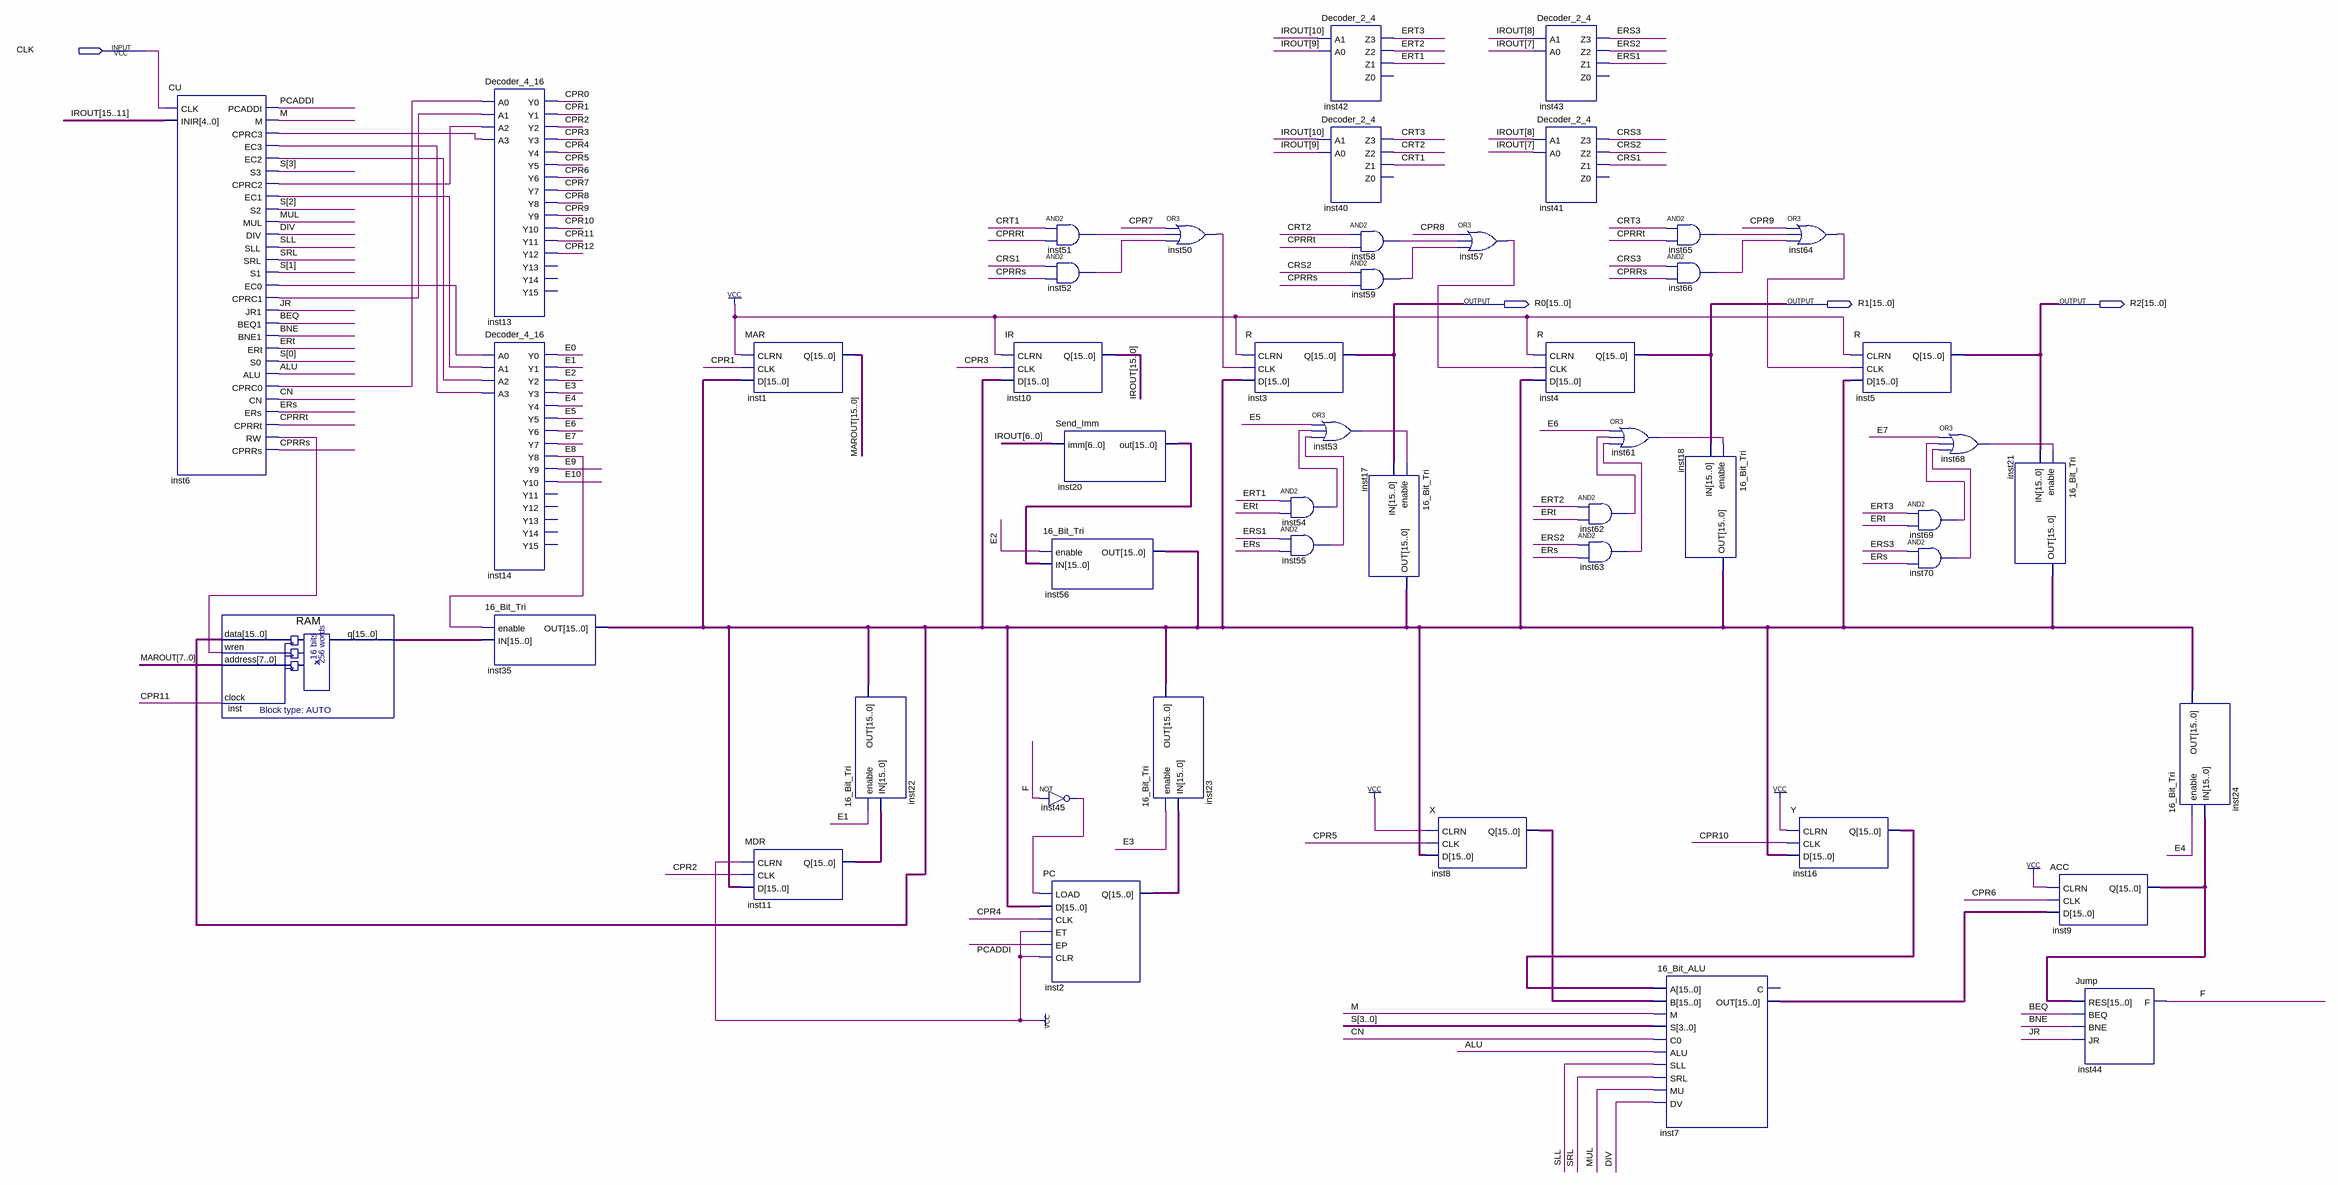
[diagram p0: schematic sheet]
// Quartus schematic Lab3.bdf as structural Verilog: 48 symbols, 4 pins
module Lab3 (
  input  CLK,
  output [15:0] R0,
  output [15:0] R1,
  output [15:0] R2
);

  wire ALU, BEQ, BNE, CN, CPR0, CPR1, CPR2, CPR3, CPR4, CPR5, CPR6, CPR7, CPR8, CPR9, CPR10, CPR11, CPR12,
       CPRRs, CPRRt, CRS1, CRS2, CRS3, CRT1, CRT2, CRT3, DIV, E0, E1, E2, E3, E4, E5, E6, E7, E8, E9, E10,
       ERs, ERS1, ERS2, ERS3, ERt, ERT1, ERT2, ERT3, F, inst6_cprc0, inst6_cprc1, inst6_cprc2, inst6_cprc3,
       inst6_ec0, inst6_ec1, inst6_ec2, inst6_ec3, inst6_rw, inst45_out, inst50_out, inst51_out, inst52_out,
       inst53_out, inst54_out, inst55_out, inst57_out, inst58_out, inst59_out, inst61_out, inst62_out,
       inst63_out, inst64_out, inst65_out, inst66_out, inst68_out, inst69_out, inst70_out, JR, M, MUL,
       PCADDI, SLL, SRL;
  wire [3:0] S;
  wire [15:0] inst2_q, inst7_out, inst8_q, inst9_q, inst11_q, inst16_q, inst20_out, inst35_out, inst_q,
       IROUT, MAROUT;

  CU inst6 (
    .CLK(CLK), .INIR(IROUT[15:11]), .PCADDI(PCADDI), .M(M), .CPRC3(inst6_cprc3), .EC3(inst6_ec3),
    .EC2(inst6_ec2), .S3(S[3]), .CPRC2(inst6_cprc2), .EC1(inst6_ec1), .S2(S[2]), .MUL(MUL), .DIV(DIV),
    .SLL(SLL), .SRL(SRL), .S1(S[1]), .EC0(inst6_ec0), .CPRC1(inst6_cprc1), .JR1(JR), .BEQ1(BEQ), .BNE1(BNE),
    .ERt(ERt), .S0(S[0]), .ALU(ALU), .CPRC0(inst6_cprc0), .CN(CN), .ERs(ERs), .CPRRt(CPRRt), .RW(inst6_rw),
    .CPRRs(CPRRs));
  RAM inst (.data(inst35_out), .wren(inst6_rw), .address(MAROUT[7:0]), .clock(CPR11), .q(inst_q));
  Decoder_4_16 inst13 (
    .A0(inst6_cprc0), .A1(inst6_cprc1), .A2(inst6_cprc2), .A3(inst6_cprc3), .Y0(CPR0), .Y1(CPR1), .Y2(CPR2),
    .Y3(CPR3), .Y4(CPR4), .Y5(CPR5), .Y6(CPR6), .Y7(CPR7), .Y8(CPR8), .Y9(CPR9), .Y10(CPR10), .Y11(CPR11),
    .Y12(CPR12));  // open: Y13, Y14, Y15
  Decoder_4_16 inst14 (
    .A0(inst6_ec0), .A1(inst6_ec1), .A2(inst6_ec2), .A3(inst6_ec3), .Y0(E0), .Y1(E1), .Y2(E2), .Y3(E3),
    .Y4(E4), .Y5(E5), .Y6(E6), .Y7(E7), .Y8(E8), .Y9(E9), .Y10(E10));  // open: Y11, Y12, Y13, Y14, Y15
  \16_Bit_Tri  inst35 (.enable(E8), .IN(inst_q), .OUT(inst35_out));
  MAR inst1 (.CLRN(1'b1), .CLK(CPR1), .D(inst35_out), .Q(MAROUT));
  MDR inst11 (.CLRN(1'b1), .CLK(CPR2), .D(inst35_out), .Q(inst11_q));
  \16_Bit_Tri  inst22 (.enable(E1), .IN(inst11_q), .OUT(inst35_out));
  and inst51 (inst51_out, CRT1, CPRRt);
  and inst52 (inst52_out, CRS1, CPRRs);
  IR inst10 (.CLRN(1'b1), .CLK(CPR3), .D(inst35_out), .Q(IROUT));
  \16_Bit_Tri  inst56 (.enable(E2), .IN(inst20_out), .OUT(inst35_out));
  not inst45 (inst45_out, F);
  PC inst2 (.LOAD(inst45_out), .D(inst35_out), .CLK(CPR4), .ET(1'b1), .EP(PCADDI), .CLR(1'b1), .Q(inst2_q));
  Send_Imm inst20 (.imm(IROUT[6:0]), .out(inst20_out));
  \16_Bit_Tri  inst23 (.enable(E3), .IN(inst2_q), .OUT(inst35_out));
  or inst50 (inst50_out, CPR7, inst51_out, inst52_out);
  R inst3 (.CLRN(1'b1), .CLK(inst50_out), .D(inst35_out), .Q(R0));
  and inst54 (inst54_out, ERT1, ERt);
  and inst55 (inst55_out, ERS1, ERs);
  Decoder_2_4 inst42 (.A1(IROUT[10]), .A0(IROUT[9]), .Z3(ERT3), .Z2(ERT2), .Z1(ERT1));  // open: Z0
  Decoder_2_4 inst40 (.A1(IROUT[10]), .A0(IROUT[9]), .Z3(CRT3), .Z2(CRT2), .Z1(CRT1));  // open: Z0
  and inst58 (inst58_out, CRT2, CPRRt);
  and inst59 (inst59_out, CRS2, CPRRs);
  or inst53 (inst53_out, E5, inst54_out, inst55_out);
  \16_Bit_Tri  inst17 (.enable(inst53_out), .IN(R0), .OUT(inst35_out));
  X inst8 (.CLRN(1'b1), .CLK(CPR5), .D(inst35_out), .Q(inst8_q));
  or inst57 (inst57_out, CPR8, inst58_out, inst59_out);
  Decoder_2_4 inst43 (.A1(IROUT[8]), .A0(IROUT[7]), .Z3(ERS3), .Z2(ERS2), .Z1(ERS1));  // open: Z0
  Decoder_2_4 inst41 (.A1(IROUT[8]), .A0(IROUT[7]), .Z3(CRS3), .Z2(CRS2), .Z1(CRS1));  // open: Z0
  R inst4 (.CLRN(1'b1), .CLK(inst57_out), .D(inst35_out), .Q(R1));
  and inst62 (inst62_out, ERT2, ERt);
  and inst63 (inst63_out, ERS2, ERs);
  or inst61 (inst61_out, E6, inst62_out, inst63_out);
  \16_Bit_ALU  inst7 (
    .A(inst16_q), .B(inst8_q), .M(M), .S(S), .C0(CN), .ALU(ALU), .SLL(SLL), .SRL(SRL), .MU(MUL), .DV(DIV),
    .OUT(inst7_out));  // open: C
  and inst65 (inst65_out, CRT3, CPRRt);
  and inst66 (inst66_out, CRS3, CPRRs);
  \16_Bit_Tri  inst18 (.enable(inst61_out), .IN(R1), .OUT(inst35_out));
  or inst64 (inst64_out, CPR9, inst65_out, inst66_out);
  Y inst16 (.CLRN(1'b1), .CLK(CPR10), .D(inst35_out), .Q(inst16_q));
  R inst5 (.CLRN(1'b1), .CLK(inst64_out), .D(inst35_out), .Q(R2));
  and inst69 (inst69_out, ERT3, ERt);
  and inst70 (inst70_out, ERS3, ERs);
  or inst68 (inst68_out, E7, inst69_out, inst70_out);
  \16_Bit_Tri  inst21 (.enable(inst68_out), .IN(R2), .OUT(inst35_out));
  ACC inst9 (.CLRN(1'b1), .CLK(CPR6), .D(inst7_out), .Q(inst9_q));
  Jump inst44 (.RES(inst9_q), .BEQ(BEQ), .BNE(BNE), .JR(JR), .F(F));
  \16_Bit_Tri  inst24 (.enable(E4), .IN(inst9_q), .OUT(inst35_out));
endmodule
